# Altium schematic sheet Supplies_ADP2164.SchDoc
size 431 x 279 mm; Organization: ORGANIZATION; Address1: ADDRESS 1; Address2: ADDRESS 2; Address3: ADDRESS 3; Address4: ADDRESS 4; Revision: -; SheetNumber: 6; SheetTotal: 8; ENG_APP_DATE: --/--/--; DSN_APP_DATE: --/--/--; CHK_APP_DATE: --/--/--; SPICEModelCacheRLJPMQWR: <root> / <DocumentId>RLJPMQWR</DocumentId> / </root>
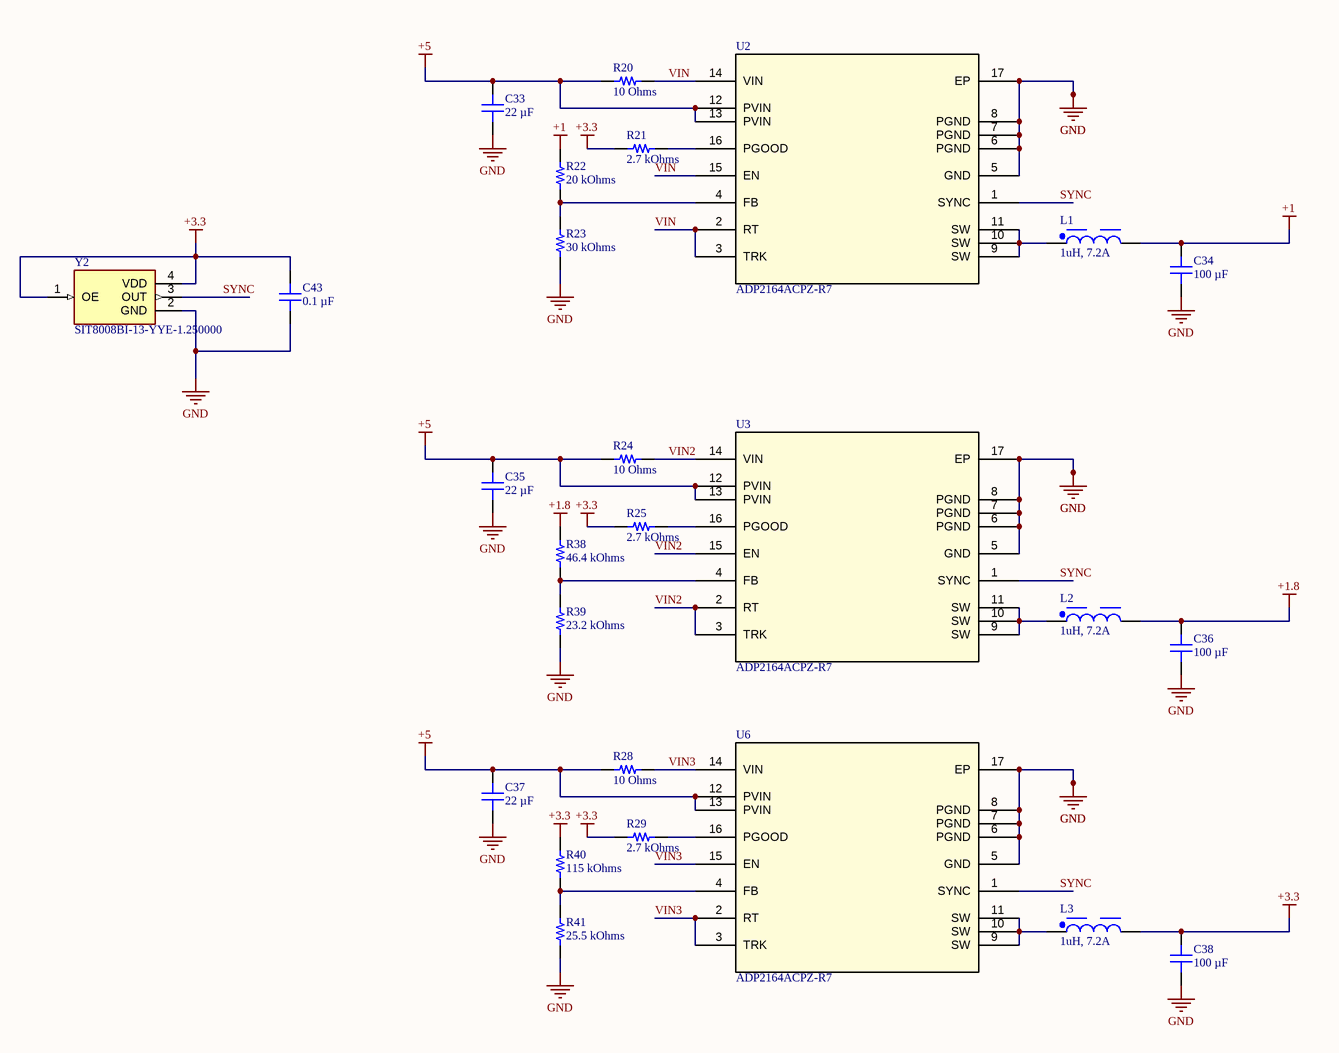
[diagram p0: Supplies_ADP2164.SchDoc]

## Parts
C33  22 µF  [CAP 0603_1608]
C34  100 µF  [CAP 1210_3225 - 1MM]
C35  22 µF  [CAP 0603_1608]
C36  100 µF  [CAP 1210_3225 - 1MM]
C37  22 µF  [CAP 0603_1608]
C38  100 µF  [CAP 1210_3225 - 1MM]
C43  0.1 µF  [CAP 0201_0603]
L1  1uH, 7.2A  [WE-MAPI_4020]
L2  1uH, 7.2A  [WE-MAPI_4020]
L3  1uH, 7.2A  [WE-MAPI_4020]
R20  10 Ohms  [RES 0201_0603]
R21  2.7 kOhms  [RES 0201_0603]
R22  20 kOhms  [RES 0201_0603]
R23  30 kOhms  [RES 0201_0603]
R24  10 Ohms  [RES 0201_0603]
R25  2.7 kOhms  [RES 0201_0603]
R28  10 Ohms  [RES 0201_0603]
R29  2.7 kOhms  [RES 0201_0603]
R38  46.4 kOhms  [RES 0201_0603]
R39  23.2 kOhms  [RES 0201_0603]
R40  115 kOhms  [RES 0201_0603]
R41  25.5 kOhms  [RES 0201_0603]
U2  ADP2164ACPZ-R7  [CP_16_17_ADI]
U3  ADP2164ACPZ-R7  [CP_16_17_ADI]
U6  ADP2164ACPZ-R7  [CP_16_17_ADI]
Y2  SIT8008BI-13-YYE-1.250000  [OSC_SIT8008BI-13-33E-33.333330E]

## Nets
+1: C34.2 L1.2 R22.2
+1.8: C36.2 L2.2 R38.2
+3.3: C38.2 C43.2 L3.2 R21.2 R25.2 R29.2 R40.2 Y2.1(OE) Y2.4(VDD)
+5: C33.2 C35.2 C37.2 R20.1 R24.1 R28.1 U2.12(PVIN) U2.13(PVIN) U3.12(PVIN) U3.13(PVIN) U6.12(PVIN) U6.13(PVIN)
GND: C33.1 C34.1 C35.1 C36.1 C37.1 C38.1 C43.1 R23.2 R39.1 R41.1 U2.5(GND) U2.6(PGND) U2.7(PGND) U2.8(PGND) U2.17(EP) U3.5(GND) U3.6(PGND) U3.7(PGND) U3.8(PGND) U3.17(EP) U6.5(GND) U6.6(PGND) U6.7(PGND) U6.8(PGND) U6.17(EP) Y2.2(GND)
SYNC: U2.1(SYNC) U3.1(SYNC) U6.1(SYNC) Y2.3(OUT)
VIN: R20.2 U2.2(RT) U2.3(TRK) U2.14(VIN) U2.15(EN)
VIN2: R24.2 U3.2(RT) U3.3(TRK) U3.14(VIN) U3.15(EN)
VIN3: R28.2 U6.2(RT) U6.3(TRK) U6.14(VIN) U6.15(EN)
NetL1_1: L1.1 U2.9(SW) U2.10(SW) U2.11(SW)
NetL2_1: L2.1 U3.9(SW) U3.10(SW) U3.11(SW)
NetL3_1: L3.1 U6.9(SW) U6.10(SW) U6.11(SW)
NetR21_1: R21.1 U2.16(PGOOD)
NetR22_1: R22.1 R23.1 U2.4(FB)
NetR25_1: R25.1 U3.16(PGOOD)
NetR29_1: R29.1 U6.16(PGOOD)
NetR38_1: R38.1 R39.2 U3.4(FB)
NetR40_1: R40.1 R41.2 U6.4(FB)

## Notes on the sheet
- DWG. NO.
- REV.
- SHT.
- REVISION
- DESCRIPTION
- DATE
- APPROVED
- ENG:
- APPROVALS
- PROJECT
- DSN:
- CHK:
- REFERENCE DOCUMENTS
- PROJECT REVISION:
- TITLE
- SimulaVR
- DOCUMENT REVISION:
- DESIGN ITEM:
- BOM:
- FAB DWG:
- PCB DWG:
- ASSY DWG:
- SCALE:
- SIZE
- B
- CAGE CODE
- FILE NAME
- DWG NO.
- SHEET
- OF
- REV

## Library data of the parts
C33 C35 C37 = GRM187R61A226ME15D: CAP CER 22UF 10V X5R 0603; manufacturer: Murata Electronics; Tolerance: ±20%; Part Number: GRM187R61A226ME15D; Value: 22 µF; Applications: General Purpose; Capacitance: 22 µF; componentlink1description: Datasheet; componentlink1url: https://psearch.en.murata.com/capacitor/product/GRM187R61A226ME15%23.pdf; componentlink2description: DigiKey Link; componentlink2url: https://www.digikey.com/en/products/detail/murata-electronics/GRM187R61A226ME15D/5877406; Device Package: 0603 (1608 Metric); lastupdated: 2022-04-12 22:07:51; Lifecycle Status: Active; Minimum Order: 1; Mounting Type: Surface Mount, MLCC; Operating Temperature: -55°C ~ 85°C; Package / Case: 0603 (1608 Metric); packaging: TapeAndReel; partid: 16014; Part Status: Active; price: 0.08; series: GRM; Size / Dimension: 0.063" L x 0.031" W (1.60mm x 0.80mm); Supplier 1: DigiKey; Supplier Part Number 1: 490-13243-1-ND; Temperature Coefficient: X5R; Thickness (Max): 0.031" (0.80mm); Voltage - Rated: 10V
C34 C36 C38 = GRM32ER61A107ME20K: CAP CER 100UF 10V X5R 1210; manufacturer: Murata Electronics; Tolerance: ±20%; Part Number: GRM32ER61A107ME20K; Value: 100 µF; Applications: General Purpose; Capacitance: 100 µF; componentlink1description: Datasheet; componentlink1url: https://search.murata.co.jp/Ceramy/image/img/A01X/G101/ENG/GRM32ER61A107ME20-01.pdf; componentlink2description: DigiKey Link; componentlink2url: https://www.digikey.com/en/products/detail/murata-electronics/GRM32ER61A107ME20K/4905632; Device Package: 1210 (3225 Metric); lastupdated: 2022-04-12 22:28:40; Lifecycle Status: Active; Minimum Order: 1; Mounting Type: Surface Mount, MLCC; Operating Temperature: -55°C ~ 85°C; Package / Case: 1210 (3225 Metric); packaging: TapeAndReel; partid: 23754; Part Status: Active; price: 0.22; series: GRM; Size / Dimension: 0.126" L x 0.098" W (3.20mm x 2.50mm); Supplier 1: DigiKey; Supplier Part Number 1: 490-14681-1-ND; Temperature Coefficient: X5R; Thickness (Max): 0.106" (2.70mm); Voltage - Rated: 10V
C43 = GRM033R61A104KE15D: CAP CER 0.1UF 10V X5R 0201; manufacturer: Murata Electronics; Tolerance: ±10%; Part Number: GRM033R61A104KE15D; Value: 0.1 µF; Applications: General Purpose; Capacitance: 0.1 µF; componentlink1description: Datasheet; componentlink1url: https://www.murata.com/~/media/webrenewal/support/library/catalog/products/capacitor/mlcc/c02e.ashx?la=en-us; componentlink2description: DigiKey Link; componentlink2url: https://www.digikey.com/en/products/detail/murata-electronics/GRM033R61A104KE15D/2269163; Device Package: 0201 (0603 Metric); lastupdated: 2022-04-12 22:01:55; Lifecycle Status: Active; Minimum Order: 1; Mounting Type: Surface Mount, MLCC; Operating Temperature: -55°C ~ 85°C; Package / Case: 0201 (0603 Metric); packaging: CutTape; partid: 1641; Part Status: Active; price: 0.01; series: GRM; Size / Dimension: 0.024" L x 0.012" W (0.60mm x 0.30mm); Supplier 1: DigiKey; Supplier Part Number 1: 490-5881-1-ND; Temperature Coefficient: X5R; Thickness (Max): 0.013" (0.33mm); Voltage - Rated: 10V
L1-L3 = 74438356010: WE-MAPI SMT Power Inductor, size 4020, 1uH, 7.2A; Manufacturer: Wurth Elektronik; DC Resistance typ.: 12mOhm; DC Resistance max.: 15mOhm; Self Resonant Frequency: 55MHz; Saturation Current: 9A; ComponentLink1Description: Manufacturer; ComponentLink1URL: http://www.we-online.de; ComponentLink2Description: Datasheet; ComponentLink2URL: https://www.we-online.com/catalog/datasheet/74438356010.pdf; Mounting Technology: SMT; Operating Temperature: -40 to +125degC; Packaging: Tape and Reel; Size: 4020; Inductance: 1uH; Manufacturer Part Number: 74438356010; Rated Current: 7.2A; Height: 2.1mm; Length: 4.1mm; Width: 4.1mm
R20 R24 R28 = RC0201JR-0710RL: RES 10 OHM 5% 1/20W 0201; Manufacturer: Yageo; Power (Watts): 0.05W, 1/20W; Temperature Coefficient: -100/ +350ppm/°C; Part Number: RC0201JR-0710RL; Value: 10 Ohms; ComponentLink1Description: Datasheet; ComponentLink1URL: https://www.yageo.com/upload/media/product/productsearch/datasheet/rchip/PYu-RC_Group_51_RoHS_L_10.pdf; ComponentLink2Description: DigiKey Link; ComponentLink2URL: https://www.digikey.com/en/products/detail/yageo/RC0201JR-0710RL/1948902; Composition: Thick Film; Device Package: 0201 (0603 Metric); Features: Moisture Resistant; Height - Seated (Max): 0.010" (0.26mm); LastUpdated: 2022-04-12 22:15:44; Lifecycle Status: Active; Minimum Order: 1; Number of Terminations: 2; Operating Temperature: -55°C ~ 125°C; Package / Case: 0201 (0603 Metric); Packaging: CutTape; PartId: 2283; Part Status: Active; Price: 0.01; Resistance: 10 Ohms; Series: RC_L; Size / Dimension: 0.024" L x 0.012" W (0.60mm x 0.30mm); Supplier 1: DigiKey; Supplier Part Number 1: 311-10NCT-ND; Supplier Device Package: 0201; Tolerance: ±5%
R21 R25 R29 = ERJ-U01J272C: RES 2.7K OHM 5% 1/20W 0201 SMD; Manufacturer: Panasonic Electronic Components; Power (Watts): 0.05W, 1/20W; Temperature Coefficient: ±200ppm/°C; Part Number: ERJ-U01J272C; Value: 2.7 kOhms; ComponentLink1Description: Datasheet; ComponentLink1URL: https://industrial.panasonic.com/cdbs/www-data/pdf/RDP0000/AOA0000C334.pdf; ComponentLink2Description: DigiKey Link; ComponentLink2URL: https://www.digikey.com/en/products/detail/panasonic-electronic-components/ERJ-U01J272C/11641374; Composition: Thick Film; Device Package: 0201 (0603 Metric); Features: Anti-Sulfur; Height - Seated (Max): 0.010" (0.26mm); LastUpdated: 2022-04-12 22:15:26; Lifecycle Status: Active; Minimum Order: 1; Number of Terminations: 2; Operating Temperature: -55°C ~ 125°C; Package / Case: 0201 (0603 Metric); Packaging: TapeAndReel; PartId: 64645; Part Status: Active; Price: 0.04; Resistance: 2.7 kOhms; Series: ERJ-U01; Size / Dimension: 0.024" L x 0.012" W (0.60mm x 0.30mm); Supplier 1: DigiKey; Supplier Part Number 1: 10-ERJ-U01J272CCT-ND; Supplier Device Package: 0201; Tolerance: ±5%
R22 = ERJ-1GNF2002C: RES SMD 20K OHM 1% 1/20W 0201; Manufacturer: Panasonic Electronic Components; Power (Watts): 0.05W, 1/20W; Temperature Coefficient: ±200ppm/°C; Part Number: ERJ-1GNF2002C; Value: 20 kOhms; ComponentLink1Description: Datasheet; ComponentLink1URL: https://industrial.panasonic.com/cdbs/www-data/pdf/RDA0000/AOA0000C304.pdf; ComponentLink2Description: DigiKey Link; ComponentLink2URL: https://www.digikey.com/en/products/detail/panasonic-electronic-components/ERJ-1GNF2002C/2036258; Composition: Thick Film; Device Package: 0201 (0603 Metric); Features: Automotive AEC-Q200; Height - Seated (Max): 0.010" (0.26mm); LastUpdated: 2022-04-12 22:15:35; Lifecycle Status: Active; Minimum Order: 1; Number of Terminations: 2; Operating Temperature: -55°C ~ 125°C; Package / Case: 0201 (0603 Metric); Packaging: TapeAndReel; PartId: 4105; Part Status: Active; Price: 0.01; Ratings: AEC-Q200; Resistance: 20 kOhms; Series: ERJ-1GN; Size / Dimension: 0.024" L x 0.012" W (0.60mm x 0.30mm); Supplier 1: DigiKey; Supplier Part Number 1: P122813CT-ND; Supplier Device Package: 0201; Tolerance: ±1%
R23 = ERJ-1GNF3002C: RES SMD 30K OHM 1% 1/20W 0201; Manufacturer: Panasonic Electronic Components; Power (Watts): 0.05W, 1/20W; Temperature Coefficient: ±200ppm/°C; Part Number: ERJ-1GNF3002C; Value: 30 kOhms; ComponentLink1Description: Datasheet; ComponentLink1URL: https://industrial.panasonic.com/cdbs/www-data/pdf/RDA0000/AOA0000C304.pdf; ComponentLink2Description: DigiKey Link; ComponentLink2URL: https://www.digikey.com/en/products/detail/panasonic-electronic-components/ERJ-1GNF3002C/2036278; Composition: Thick Film; Device Package: 0201 (0603 Metric); Features: Automotive AEC-Q200; Height - Seated (Max): 0.010" (0.26mm); LastUpdated: 2022-04-12 22:15:37; Lifecycle Status: Active; Minimum Order: 1; Number of Terminations: 2; Operating Temperature: -55°C ~ 125°C; Package / Case: 0201 (0603 Metric); Packaging: TapeAndReel; PartId: 3723; Part Status: Active; Price: 0.01; Ratings: AEC-Q200; Resistance: 30 kOhms; Series: ERJ-1GN; Size / Dimension: 0.024" L x 0.012" W (0.60mm x 0.30mm); Supplier 1: DigiKey; Supplier Part Number 1: P122913CT-ND; Supplier Device Package: 0201; Tolerance: ±1%
R38 = ERJ-1GNF4642C: RES SMD 46.4K OHM 1% 1/20W 0201; Manufacturer: Panasonic Electronic Components; Power (Watts): 0.05W, 1/20W; Temperature Coefficient: ±200ppm/°C; Part Number: ERJ-1GNF4642C; Value: 46.4 kOhms; ComponentLink1Description: Datasheet; ComponentLink1URL: https://industrial.panasonic.com/cdbs/www-data/pdf/RDA0000/AOA0000C304.pdf; ComponentLink2Description: DigiKey Link; ComponentLink2URL: https://www.digikey.com/en/products/detail/panasonic-electronic-components/ERJ-1GNF4642C/2036301; Composition: Thick Film; Device Package: 0201 (0603 Metric); Features: Automotive AEC-Q200; Height - Seated (Max): 0.010" (0.26mm); LastUpdated: 2022-04-12 22:15:43; Lifecycle Status: Active; Minimum Order: 1; Number of Terminations: 2; Operating Temperature: -55°C ~ 125°C; Package / Case: 0201 (0603 Metric); Packaging: TapeAndReel; PartId: 2404; Part Status: Active; Price: 0.01; Ratings: AEC-Q200; Resistance: 46.4 kOhms; Series: ERJ-1GN; Size / Dimension: 0.024" L x 0.012" W (0.60mm x 0.30mm); Supplier 1: DigiKey; Supplier Part Number 1: P123027CT-ND; Supplier Device Package: 0201; Tolerance: ±1%
R39 = ERJ-1GNF2322C: RES SMD 23.2K OHM 1% 1/20W 0201; Manufacturer: Panasonic Electronic Components; Power (Watts): 0.05W, 1/20W; Temperature Coefficient: ±200ppm/°C; Part Number: ERJ-1GNF2322C; Value: 23.2 kOhms; ComponentLink1Description: Datasheet; ComponentLink1URL: https://industrial.panasonic.com/cdbs/www-data/pdf/RDA0000/AOA0000C304.pdf; ComponentLink2Description: DigiKey Link; ComponentLink2URL: https://www.digikey.com/en/products/detail/panasonic-electronic-components/ERJ-1GNF2322C/2036265; Composition: Thick Film; Device Package: 0201 (0603 Metric); Features: Automotive AEC-Q200; Height - Seated (Max): 0.010" (0.26mm); LastUpdated: 2022-04-12 22:15:43; Lifecycle Status: Active; Minimum Order: 1; Number of Terminations: 2; Operating Temperature: -55°C ~ 125°C; Package / Case: 0201 (0603 Metric); Packaging: TapeAndReel; PartId: 2324; Part Status: Active; Price: 0.01; Ratings: AEC-Q200; Resistance: 23.2 kOhms; Series: ERJ-1GN; Size / Dimension: 0.024" L x 0.012" W (0.60mm x 0.30mm); Supplier 1: DigiKey; Supplier Part Number 1: P122848CT-ND; Supplier Device Package: 0201; Tolerance: ±1%
R40 = ERJ-1GNF1153C: RES SMD 115K OHM 1% 1/20W 0201; Manufacturer: Panasonic Electronic Components; Power (Watts): 0.05W, 1/20W; Temperature Coefficient: ±200ppm/°C; Part Number: ERJ-1GNF1153C; Value: 115 kOhms; ComponentLink1Description: Datasheet; ComponentLink1URL: https://industrial.panasonic.com/cdbs/www-data/pdf/RDA0000/AOA0000C304.pdf; ComponentLink2Description: DigiKey Link; ComponentLink2URL: https://www.digikey.com/en/products/detail/panasonic-electronic-components/ERJ-1GNF1153C/2036346; Composition: Thick Film; Device Package: 0201 (0603 Metric); Features: Automotive AEC-Q200; Height - Seated (Max): 0.010" (0.26mm); LastUpdated: 2022-04-12 22:15:35; Lifecycle Status: Active; Minimum Order: 1; Number of Terminations: 2; Operating Temperature: -55°C ~ 125°C; Package / Case: 0201 (0603 Metric); Packaging: TapeAndReel; PartId: 4069; Part Status: Active; Price: 0.01; Ratings: AEC-Q200; Resistance: 115 kOhms; Series: ERJ-1GN; Size / Dimension: 0.024" L x 0.012" W (0.60mm x 0.30mm); Supplier 1: DigiKey; Supplier Part Number 1: P122683CT-ND; Supplier Device Package: 0201; Tolerance: ±1%
R41 = ERJ-1GNF2552C: RES SMD 25.5K OHM 1% 1/20W 0201; Manufacturer: Panasonic Electronic Components; Power (Watts): 0.05W, 1/20W; Temperature Coefficient: ±200ppm/°C; Part Number: ERJ-1GNF2552C; Value: 25.5 kOhms; ComponentLink1Description: Datasheet; ComponentLink1URL: https://industrial.panasonic.com/cdbs/www-data/pdf/RDA0000/AOA0000C304.pdf; ComponentLink2Description: DigiKey Link; ComponentLink2URL: https://www.digikey.com/en/products/detail/panasonic-electronic-components/ERJ-1GNF2552C/2036270; Composition: Thick Film; Device Package: 0201 (0603 Metric); Features: Automotive AEC-Q200; Height - Seated (Max): 0.010" (0.26mm); LastUpdated: 2022-04-12 22:15:43; Lifecycle Status: Active; Minimum Order: 1; Number of Terminations: 2; Operating Temperature: -55°C ~ 125°C; Package / Case: 0201 (0603 Metric); Packaging: TapeAndReel; PartId: 2387; Part Status: Active; Price: 0.01; Ratings: AEC-Q200; Resistance: 25.5 kOhms; Series: ERJ-1GN; Size / Dimension: 0.024" L x 0.012" W (0.60mm x 0.30mm); Supplier 1: DigiKey; Supplier Part Number 1: P122873CT-ND; Supplier Device Package: 0201; Tolerance: ±1%
U2 U3 U6 = ADP2164ACPZ-R7: No Description Available; Mfr_Name: Analog Devices Inc; Copyright: Copyright (C) 2022 Ultra Librarian. All rights reserved.; Manufacturer_Part_Number: ADP2164ACPZ-R7; RefDes: RefDes; Type: DEV
Y2 = SIT8008BI-13-33E-33.333330E: Programmable, Low Power Oscillator, -40 To 85c, 2520, 50ppm, 3.3v, 33.33333mhz, Oe, Smd; MF: {'manufacturer': u'SiTIME'}; Availability: Unavailable; Price: None; Package: None; Value: *; MP: SIT8008BI-13-33E-33.333330E